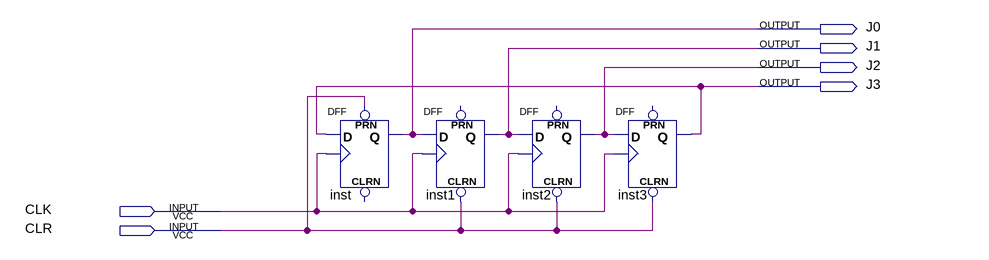
[diagram p0: schematic sheet]
// Quartus schematic rhythm.bdf as structural Verilog: 4 symbols, 6 pins
module rhythm (
  input  CLK,
  input  CLR,
  output J0,
  output J1,
  output J2,
  output J3
);

  DFF inst (.CLK(CLK), .D(J3), .PRN(CLR), .Q(J0));  // open: CLRN
  DFF inst1 (.CLRN(CLR), .CLK(CLK), .D(J0), .Q(J1));  // open: PRN
  DFF inst2 (.CLRN(CLR), .CLK(CLK), .D(J1), .Q(J2));  // open: PRN
  DFF inst3 (.CLRN(CLR), .CLK(CLK), .D(J2), .Q(J3));  // open: PRN
endmodule
